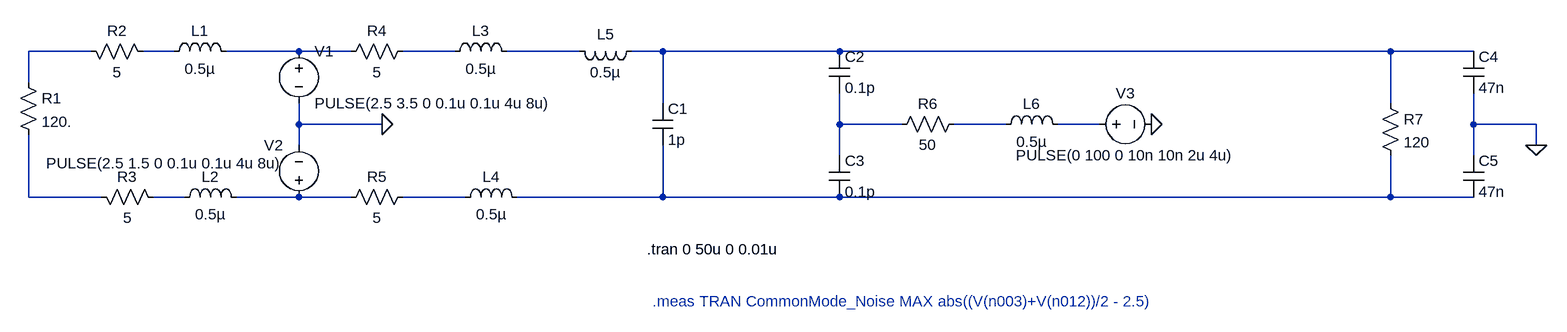
[diagram p0: schematic shielding_ps2.asc]
shielding_ps2.asc, the LTspice schematic file:
Version 4.1
SHEET 1 1972 680
WIRE -272 48 -368 48
WIRE -144 48 -192 48
WIRE 48 48 -64 48
WIRE 128 48 48 48
WIRE 288 48 208 48
WIRE 480 48 368 48
WIRE 608 48 560 48
WIRE 880 48 608 48
WIRE 1728 48 880 48
WIRE 1856 48 1728 48
WIRE -368 96 -368 48
WIRE 608 128 608 48
WIRE 1728 128 1728 48
WIRE 48 160 48 128
WIRE 176 160 48 160
WIRE 880 160 880 112
WIRE 976 160 880 160
WIRE 1136 160 1056 160
WIRE 1280 160 1216 160
WIRE 1856 160 1856 112
WIRE 1952 160 1856 160
WIRE 48 192 48 160
WIRE 1952 192 1952 160
WIRE 880 208 880 160
WIRE 1856 208 1856 160
WIRE -368 272 -368 176
WIRE -256 272 -368 272
WIRE -128 272 -176 272
WIRE 48 272 -48 272
WIRE 128 272 48 272
WIRE 304 272 208 272
WIRE 608 272 608 192
WIRE 608 272 384 272
WIRE 880 272 608 272
WIRE 1728 272 1728 208
WIRE 1728 272 880 272
WIRE 1856 272 1728 272
FLAG 1360 160 0
FLAG 176 160 0
FLAG 1952 192 0
SYMBOL res -384 80 R0
SYMATTR InstName R1
SYMATTR Value 120.
SYMBOL res -288 32 M90
WINDOW 0 0 56 VBottom 2
WINDOW 3 32 56 VTop 2
SYMATTR InstName R2
SYMATTR Value 5
SYMBOL res -272 256 M90
WINDOW 0 0 56 VBottom 2
WINDOW 3 32 56 VTop 2
SYMATTR InstName R3
SYMATTR Value 5
SYMBOL ind -48 64 M270
WINDOW 0 32 56 VTop 2
WINDOW 3 5 56 VBottom 2
SYMATTR InstName L1
SYMATTR Value 0.5µ
SYMATTR SpiceLine Rser=1m
SYMBOL ind -32 288 M270
WINDOW 0 32 56 VTop 2
WINDOW 3 5 56 VBottom 2
SYMATTR InstName L2
SYMATTR Value 0.5µ
SYMATTR SpiceLine Rser=1m
SYMBOL voltage 48 32 R0
WINDOW 123 0 0 Left 0
WINDOW 39 0 0 Left 0
SYMATTR InstName V1
SYMATTR Value PULSE(2.5 3.5 0 0.1u 0.1u 4u 8u)
SYMBOL voltage 48 288 R180
WINDOW 0 24 96 Left 2
WINDOW 3 24 68 Left 2
WINDOW 123 0 0 Left 0
WINDOW 39 0 0 Left 0
SYMATTR InstName V2
SYMATTR Value PULSE(2.5 1.5 0 0.1u 0.1u 4u 8u)
SYMBOL res 224 32 R90
WINDOW 0 0 56 VBottom 2
WINDOW 3 32 56 VTop 2
SYMATTR InstName R4
SYMATTR Value 5
SYMBOL res 224 256 R90
WINDOW 0 0 56 VBottom 2
WINDOW 3 32 56 VTop 2
SYMATTR InstName R5
SYMATTR Value 5
SYMBOL ind 272 64 R270
WINDOW 0 32 56 VTop 2
WINDOW 3 5 56 VBottom 2
SYMATTR InstName L3
SYMATTR Value 0.5µ
SYMATTR SpiceLine Rser=1m
SYMBOL ind 288 288 R270
WINDOW 0 32 56 VTop 2
WINDOW 3 5 56 VBottom 2
SYMATTR InstName L4
SYMATTR Value 0.5µ
SYMATTR SpiceLine Rser=1m
SYMBOL ind 576 32 R90
WINDOW 0 5 56 VBottom 2
WINDOW 3 32 56 VTop 2
SYMATTR InstName L5
SYMATTR Value 0.5µ
SYMATTR SpiceLine Rser=1m
SYMBOL cap 592 128 R0
SYMATTR InstName C1
SYMATTR Value 1p
SYMBOL cap 864 48 R0
SYMATTR InstName C2
SYMATTR Value 0.1p
SYMBOL cap 864 208 R0
SYMATTR InstName C3
SYMATTR Value 0.1p
SYMBOL res 1072 144 R90
WINDOW 0 0 56 VBottom 2
WINDOW 3 32 56 VTop 2
SYMATTR InstName R6
SYMATTR Value 50
SYMBOL ind 1120 176 R270
WINDOW 0 32 56 VTop 2
WINDOW 3 5 56 VBottom 2
SYMATTR InstName L6
SYMATTR Value 0.5µ
SYMATTR SpiceLine Rser=1m
SYMBOL res 1712 112 R0
SYMATTR InstName R7
SYMATTR Value 120
SYMBOL voltage 1264 160 R270
WINDOW 0 32 56 VTop 2
WINDOW 3 -32 56 VBottom 2
WINDOW 123 0 0 Left 0
WINDOW 39 0 0 Left 0
SYMATTR InstName V3
SYMATTR Value PULSE(0 100 0 10n 10n 2u 4u)
SYMBOL cap 1840 48 R0
SYMATTR InstName C4
SYMATTR Value 47n
SYMBOL cap 1840 208 R0
SYMATTR InstName C5
SYMATTR Value 47n
TEXT 584 352 Left 2 !.tran 0 50u 0 0.01u
TEXT 592 432 Left 2 ;.meas TRAN CommonMode_Noise MAX abs((V(n003)+V(n012))/2 - 2.5)

The netlist it stands for:
* shielding_ps2.asc
R1 N001 N010 120.
R2 N001 N002 5
R3 N010 N011 5
L1 N003 N002 0.5µ Rser=1m
L2 N012 N011 0.5µ Rser=1m
V1 N003 0 PULSE(2.5 3.5 0 0.1u 0.1u 4u 8u)
V2 N012 0 PULSE(2.5 1.5 0 0.1u 0.1u 4u 8u)
R4 N004 N003 5
R5 N013 N012 5
L3 N004 N005 0.5µ Rser=1m
L4 N013 N014 0.5µ Rser=1m
L5 N006 N005 0.5µ Rser=1m
C1 N006 N014 1p
C2 N006 N007 0.1p
C3 N007 N014 0.1p
R6 N008 N007 50
L6 N008 N009 0.5µ Rser=1m
R7 N006 N014 120
V3 N009 0 PULSE(0 100 0 10n 10n 2u 4u)
C4 N006 0 47n
C5 0 N014 47n
.tran 0 50u 0 0.01u
* .meas TRAN CommonMode_Noise MAX abs((V(n003)+V(n012))/2 - 2.5)
.backanno
.end